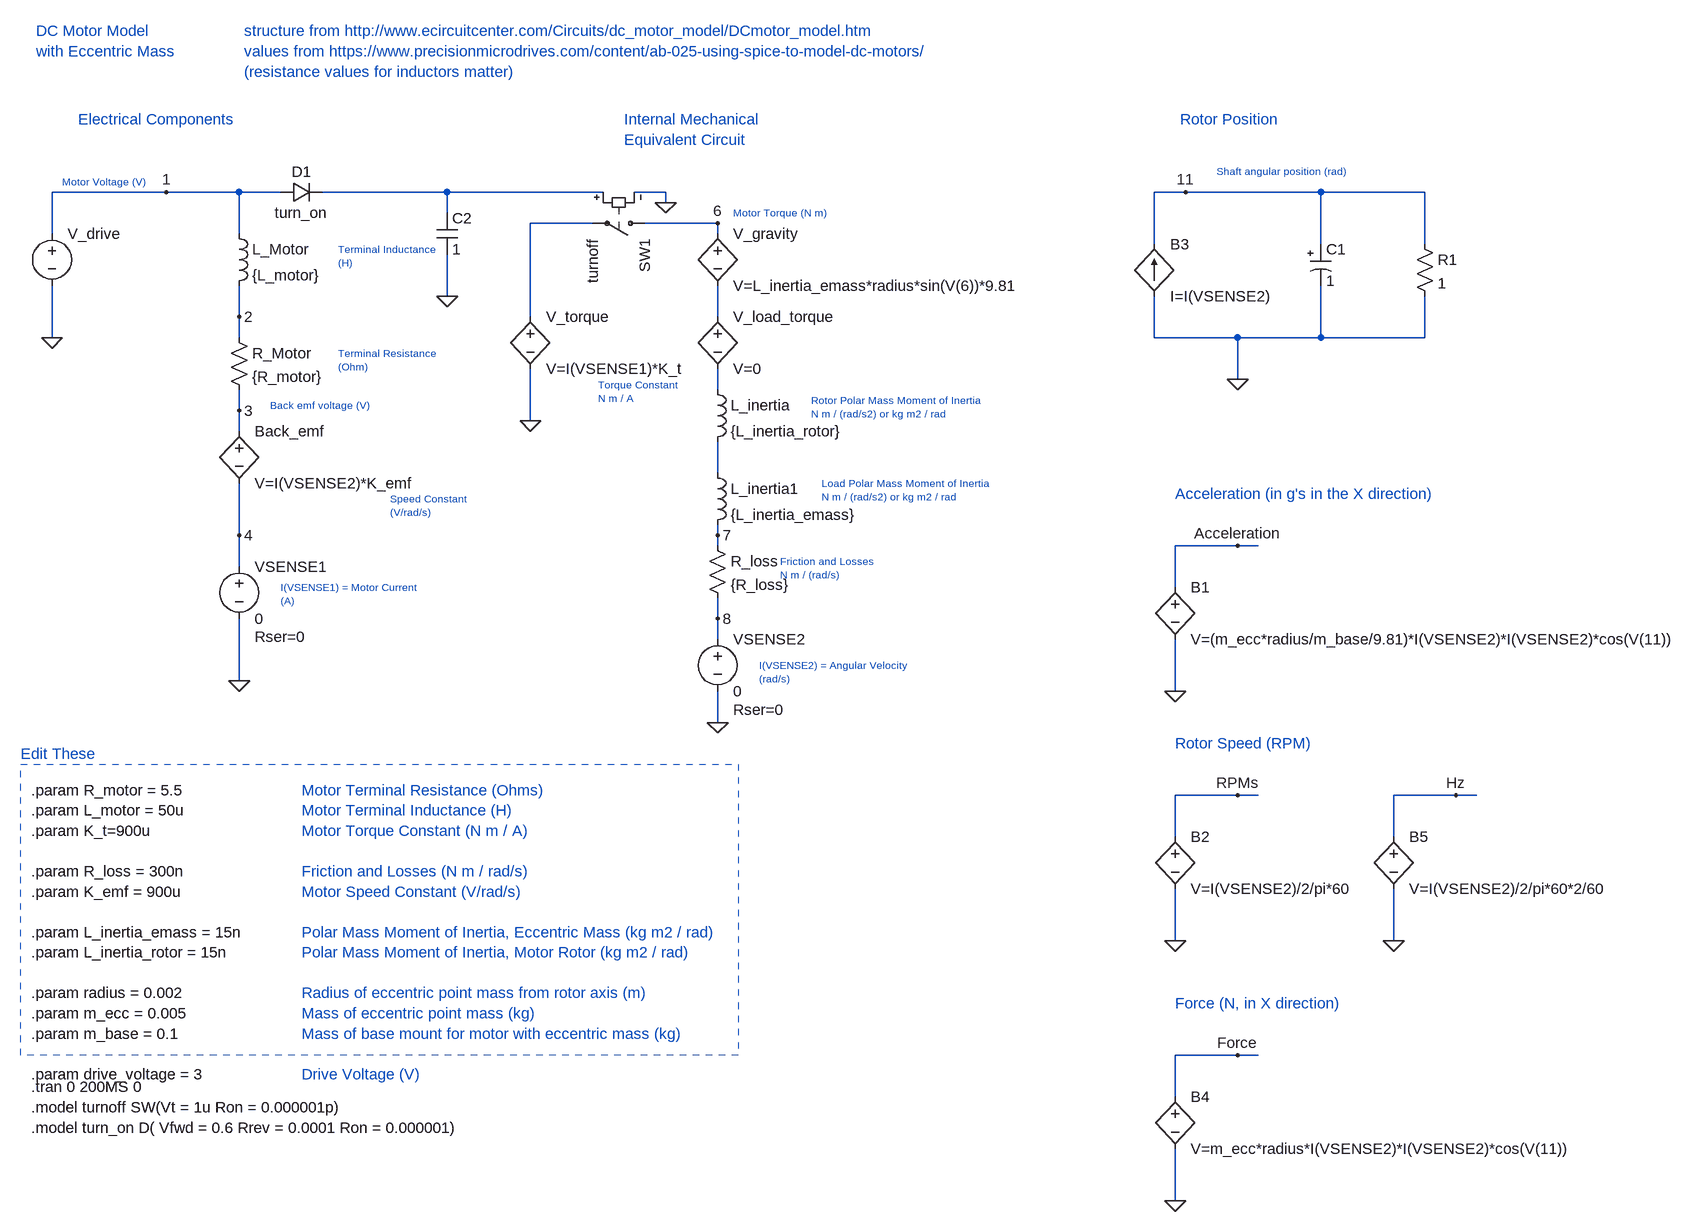
[diagram p0: schematic 2021-10-06_DC_Vibration_Motor_02.asc]
2021-10-06_DC_Vibration_Motor_02.asc, the LTspice schematic file:
Version 4
SHEET 1 3144 1316
WIRE 144 -256 -32 -256
WIRE 256 -256 144 -256
WIRE 320 -256 256 -256
WIRE 576 -256 384 -256
WIRE 816 -256 576 -256
WIRE 912 -256 864 -256
WIRE 1712 -256 1664 -256
WIRE 1920 -256 1712 -256
WIRE 2080 -256 1920 -256
WIRE 912 -240 912 -256
WIRE 576 -224 576 -256
WIRE 800 -208 704 -208
WIRE 992 -208 880 -208
WIRE -32 -192 -32 -256
WIRE 256 -192 256 -256
WIRE 992 -192 992 -208
WIRE 1664 -176 1664 -256
WIRE 1920 -176 1920 -256
WIRE 2080 -176 2080 -256
WIRE 576 -96 576 -160
WIRE 256 -64 256 -112
WIRE 704 -64 704 -208
WIRE 992 -64 992 -112
WIRE -32 -32 -32 -112
WIRE 256 -32 256 -64
WIRE 1664 -32 1664 -96
WIRE 1792 -32 1664 -32
WIRE 1920 -32 1920 -112
WIRE 1920 -32 1792 -32
WIRE 2080 -32 2080 -96
WIRE 2080 -32 1920 -32
WIRE 1792 32 1792 -32
WIRE 992 48 992 16
WIRE 256 80 256 48
WIRE 704 96 704 16
WIRE 256 112 256 80
WIRE 992 176 992 128
WIRE 256 272 256 192
WIRE 992 272 992 256
WIRE 992 288 992 272
WIRE 1792 288 1696 288
WIRE 1824 288 1792 288
WIRE 256 320 256 272
WIRE 1696 352 1696 288
WIRE 992 400 992 368
WIRE 992 432 992 400
WIRE 256 496 256 400
WIRE 1696 512 1696 432
WIRE 992 560 992 512
WIRE 1792 672 1696 672
WIRE 1824 672 1792 672
WIRE 2128 672 2032 672
WIRE 2160 672 2128 672
WIRE 1696 736 1696 672
WIRE 2032 736 2032 672
WIRE 1696 896 1696 816
WIRE 2032 896 2032 816
WIRE 1792 1072 1696 1072
WIRE 1824 1072 1792 1072
WIRE 1696 1136 1696 1072
WIRE 1696 1296 1696 1216
FLAG -32 -32 0
FLAG 256 496 0
FLAG 256 -64 2
FLAG 256 80 3
FLAG 256 272 4
FLAG 704 96 0
FLAG 992 560 0
FLAG 992 -208 6
FLAG 144 -256 1
FLAG 992 272 7
FLAG 992 400 8
FLAG 1792 32 0
FLAG 1712 -256 11
FLAG 1696 512 0
FLAG 576 -96 0
FLAG 912 -240 0
FLAG 1792 288 Acceleration
FLAG 1696 896 0
FLAG 1792 672 RPMs
FLAG 1696 1296 0
FLAG 1792 1072 Force
FLAG 2032 896 0
FLAG 2128 672 Hz
SYMBOL voltage -32 -208 R0
WINDOW 3 24 44 Invisible 1
WINDOW 123 0 0 Left 0
WINDOW 39 0 0 Left 0
SYMATTR Value PWL(0MS 0 50MS 0 50.1MS {drive_voltage} 150MS {drive_voltage} 150.1MS 0)
SYMATTR InstName V_drive
SYMBOL ind 240 -208 R0
SYMATTR InstName L_Motor
SYMATTR Value {L_motor}
SYMBOL res 240 -48 R0
SYMATTR InstName R_Motor
SYMATTR Value {R_motor}
SYMBOL voltage 256 304 R0
WINDOW 123 0 0 Left 0
WINDOW 39 24 124 Left 2
SYMATTR SpiceLine Rser=0
SYMATTR InstName VSENSE1
SYMATTR Value 0
SYMBOL ind 976 160 R0
SYMATTR InstName L_inertia1
SYMATTR Value {L_inertia_emass}
SYMATTR SpiceLine Rser=0 Rpar=0
SYMBOL res 976 272 R0
SYMATTR InstName R_loss
SYMATTR Value {R_loss}
SYMBOL voltage 992 416 R0
WINDOW 123 0 0 Left 0
WINDOW 39 24 124 Left 2
SYMATTR SpiceLine Rser=0
SYMATTR InstName VSENSE2
SYMATTR Value 0
SYMBOL polcap 1904 -176 R0
SYMATTR InstName C1
SYMATTR Value 1
SYMATTR SpiceLine Rser=0 Lser=0 Rpar=0 Cpar=0
SYMBOL res 2064 -192 R0
SYMATTR InstName R1
SYMATTR Value 1
SYMBOL bv 1696 336 R0
SYMATTR InstName B1
SYMATTR Value V=(m_ecc*radius/m_base/9.81)*I(VSENSE2)*I(VSENSE2)*cos(V(11))
SYMBOL bv 256 96 R0
SYMATTR InstName Back_emf
SYMATTR Value V=I(VSENSE2)*K_emf
SYMBOL bv 704 -80 R0
SYMATTR InstName V_torque
SYMATTR Value V=I(VSENSE1)*K_t
SYMBOL bv 992 -208 R0
SYMATTR InstName V_gravity
SYMATTR Value V=L_inertia_emass*radius*sin(V(6))*9.81
SYMBOL ind 976 32 R0
SYMATTR InstName L_inertia
SYMATTR Value {L_inertia_rotor}
SYMATTR SpiceLine Rser=0 Rpar=0
SYMBOL bv 992 -80 R0
SYMATTR InstName V_load_torque
SYMATTR Value V=0
SYMBOL bi2 1664 -176 R0
SYMATTR InstName B3
SYMATTR Value I=I(VSENSE2)
SYMBOL diode 320 -240 R270
WINDOW 0 32 32 VTop 2
WINDOW 3 0 32 VBottom 2
SYMATTR InstName D1
SYMATTR Value turn_on
SYMBOL cap 560 -224 R0
SYMATTR InstName C2
SYMATTR Value 1
SYMBOL sw 896 -208 R90
SYMATTR InstName SW1
SYMATTR Value turnoff
SYMBOL bv 1696 720 R0
SYMATTR InstName B2
SYMATTR Value V=I(VSENSE2)/2/pi*60
SYMBOL bv 1696 1120 R0
SYMATTR InstName B4
SYMATTR Value V=m_ecc*radius*I(VSENSE2)*I(VSENSE2)*cos(V(11))
SYMBOL bv 2032 720 R0
SYMATTR InstName B5
SYMATTR Value V=I(VSENSE2)/2/pi*60*2/60
TEXT 264 -504 Left 2 ;structure from http://www.ecircuitcenter.com/Circuits/dc_motor_model/DCmotor_model.htm\nvalues from https://www.precisionmicrodrives.com/content/ab-025-using-spice-to-model-dc-motors/\n(resistance values for inductors matter)
TEXT 8 -368 Left 2 ;Electrical Components
TEXT 848 -368 Left 2 ;Internal Mechanical\nEquivalent Circuit
TEXT -64 1120 Left 2 !.tran 0 200MS 0
TEXT 1152 192 Left 1 ;Load Polar Mass Moment of Inertia\nN m / (rad/s2) or kg m2 / rad
TEXT 1088 312 Left 1 ;Friction and Losses\nN m / (rad/s)
TEXT 808 40 Left 1 ;Torque Constant\nN m / A
TEXT 408 -8 Left 1 ;Terminal Resistance\n(Ohm)
TEXT 408 -168 Left 1 ;Terminal Inductance\n(H)
TEXT 488 216 Left 1 ;Speed Constant\n(V/rad/s)
TEXT -56 -504 Left 2 ;DC Motor Model\nwith Eccentric Mass
TEXT -16 -272 Left 1 ;Motor Voltage (V)
TEXT 320 352 Left 1 ;I(VSENSE1) = Motor Current\n(A)
TEXT 304 72 Left 1 ;Back emf voltage (V)
TEXT 1016 -224 Left 1 ;Motor Torque (N m)
TEXT -64 664 Left 2 !.param R_motor = 5.5\n.param L_motor = 50u\n.param K_t=900u\n \n.param R_loss = 300n\n.param K_emf = 900u\n \n.param L_inertia_emass = 15n\n.param L_inertia_rotor = 15n\n \n.param radius = 0.002\n.param m_ecc = 0.005\n.param m_base = 0.1\n \n.param drive_voltage = 3
TEXT 352 664 Left 2 ;Motor Terminal Resistance (Ohms)\nMotor Terminal Inductance (H) \nMotor Torque Constant (N m / A)\n \nFriction and Losses (N m / rad/s)\nMotor Speed Constant (V/rad/s) \n \nPolar Mass Moment of Inertia, Eccentric Mass (kg m2 / rad)\nPolar Mass Moment of Inertia, Motor Rotor (kg m2 / rad)\n \nRadius of eccentric point mass from rotor axis (m)\nMass of eccentric point mass (kg)\nMass of base mount for motor with eccentric mass (kg) \n \nDrive Voltage (V)
TEXT -80 608 Left 2 ;Edit These
TEXT 1056 472 Left 1 ;I(VSENSE2) = Angular Velocity\n(rad/s)
TEXT 1704 -368 Left 2 ;Rotor Position
TEXT 1760 -288 Left 1 ;Shaft angular position (rad)
TEXT 1696 208 Left 2 ;Acceleration (in g's in the X direction)
TEXT 1136 64 Left 1 ;Rotor Polar Mass Moment of Inertia\nN m / (rad/s2) or kg m2 / rad
TEXT -64 1152 Left 2 !.model turnoff SW(Vt = 1u Ron = 0.000001p)\n.model turn_on D( Vfwd = 0.6 Rrev = 0.0001 Ron = 0.000001)
TEXT 1696 592 Left 2 ;Rotor Speed (RPM)
TEXT 1696 992 Left 2 ;Force (N, in X direction)
RECTANGLE Normal 1024 1072 -80 624 2

The netlist it stands for:
* 2021-10-06_DC_Vibration_Motor_02.asc
V_drive 1 0 PWL(0MS 0 50MS 0 50.1MS {drive_voltage} 150MS {drive_voltage} 150.1MS 0)
L_Motor 1 2 {L_motor}
R_Motor 2 3 {R_motor}
VSENSE1 4 0 0 Rser=0
L_inertia1 N005 7 {L_inertia_emass} Rser=0 Rpar=0
R_loss 7 8 {R_loss}
VSENSE2 8 0 0 Rser=0
C1 11 0 1 Rser=0 Lser=0 Rpar=0 Cpar=0
R1 11 0 1
B1 Acceleration 0 V=(m_ecc*radius/m_base/9.81)*I(VSENSE2)*I(VSENSE2)*cos(V(11))
Back_emf 3 4 V=I(VSENSE2)*K_emf
B§V_torque N002 0 V=I(VSENSE1)*K_t
B§V_gravity 6 N003 V=L_inertia_emass*radius*sin(V(6))*9.81
L_inertia N004 N005 {L_inertia_rotor} Rser=0 Rpar=0
B§V_load_torque N003 N004 V=0
B3 0 11 I=I(VSENSE2)
D1 1 N001 turn_on
C2 N001 0 1
SW1 6 N002 N001 0 turnoff
B2 RPMs 0 V=I(VSENSE2)/2/pi*60
B4 Force 0 V=m_ecc*radius*I(VSENSE2)*I(VSENSE2)*cos(V(11))
B5 Hz 0 V=I(VSENSE2)/2/pi*60*2/60
.model D D
.lib standard.dio
* structure from http://www.ecircuitcenter.com/Circuits/dc_motor_model/DCmotor_model.htm
* values from https://www.precisionmicrodrives.com/content/ab-025-using-spice-to-model-dc-motors/
* (resistance values for inductors matter)
* Electrical Components
* Internal Mechanical
* Equivalent Circuit
.tran 0 200MS 0
* Load Polar Mass Moment of Inertia
* N m / (rad/s2) or kg m2 / rad
* Friction and Losses
* N m / (rad/s)
* Torque Constant
* N m / A
* Terminal Resistance
* (Ohm)
* Terminal Inductance
* (H)
* Speed Constant
* (V/rad/s)
* DC Motor Model
* with Eccentric Mass
* Motor Voltage (V)
* I(VSENSE1) = Motor Current
* (A)
* Back emf voltage (V)
* Motor Torque (N m)
.param R_motor = 5.5
.param L_motor = 50u
.param K_t=900u
.param R_loss = 300n
.param K_emf = 900u
.param L_inertia_emass = 15n
.param L_inertia_rotor = 15n
.param radius = 0.002
.param m_ecc = 0.005
.param m_base = 0.1
.param drive_voltage = 3
* Motor Terminal Resistance (Ohms)
* Motor Terminal Inductance (H)
* Motor Torque Constant (N m / A)
* Friction and Losses (N m / rad/s)
* Motor Speed Constant (V/rad/s)
* Polar Mass Moment of Inertia, Eccentric Mass (kg m2 / rad)
* Polar Mass Moment of Inertia, Motor Rotor (kg m2 / rad)
* Radius of eccentric point mass from rotor axis (m)
* Mass of eccentric point mass (kg)
* Mass of base mount for motor with eccentric mass (kg)
* Drive Voltage (V)
* Edit These
* I(VSENSE2) = Angular Velocity
* (rad/s)
* Rotor Position
* Shaft angular position (rad)
* Acceleration (in g's in the X direction)
* Rotor Polar Mass Moment of Inertia
* N m / (rad/s2) or kg m2 / rad
.model turnoff SW(Vt = 1u Ron = 0.000001p)
.model turn_on D( Vfwd = 0.6 Rrev = 0.0001 Ron = 0.000001)
* Rotor Speed (RPM)
* Force (N, in X direction)
.backanno
.end